# Altium schematic sheet Root.SchDoc
size A4; SheetNumber: 1; SheetTotal: 6
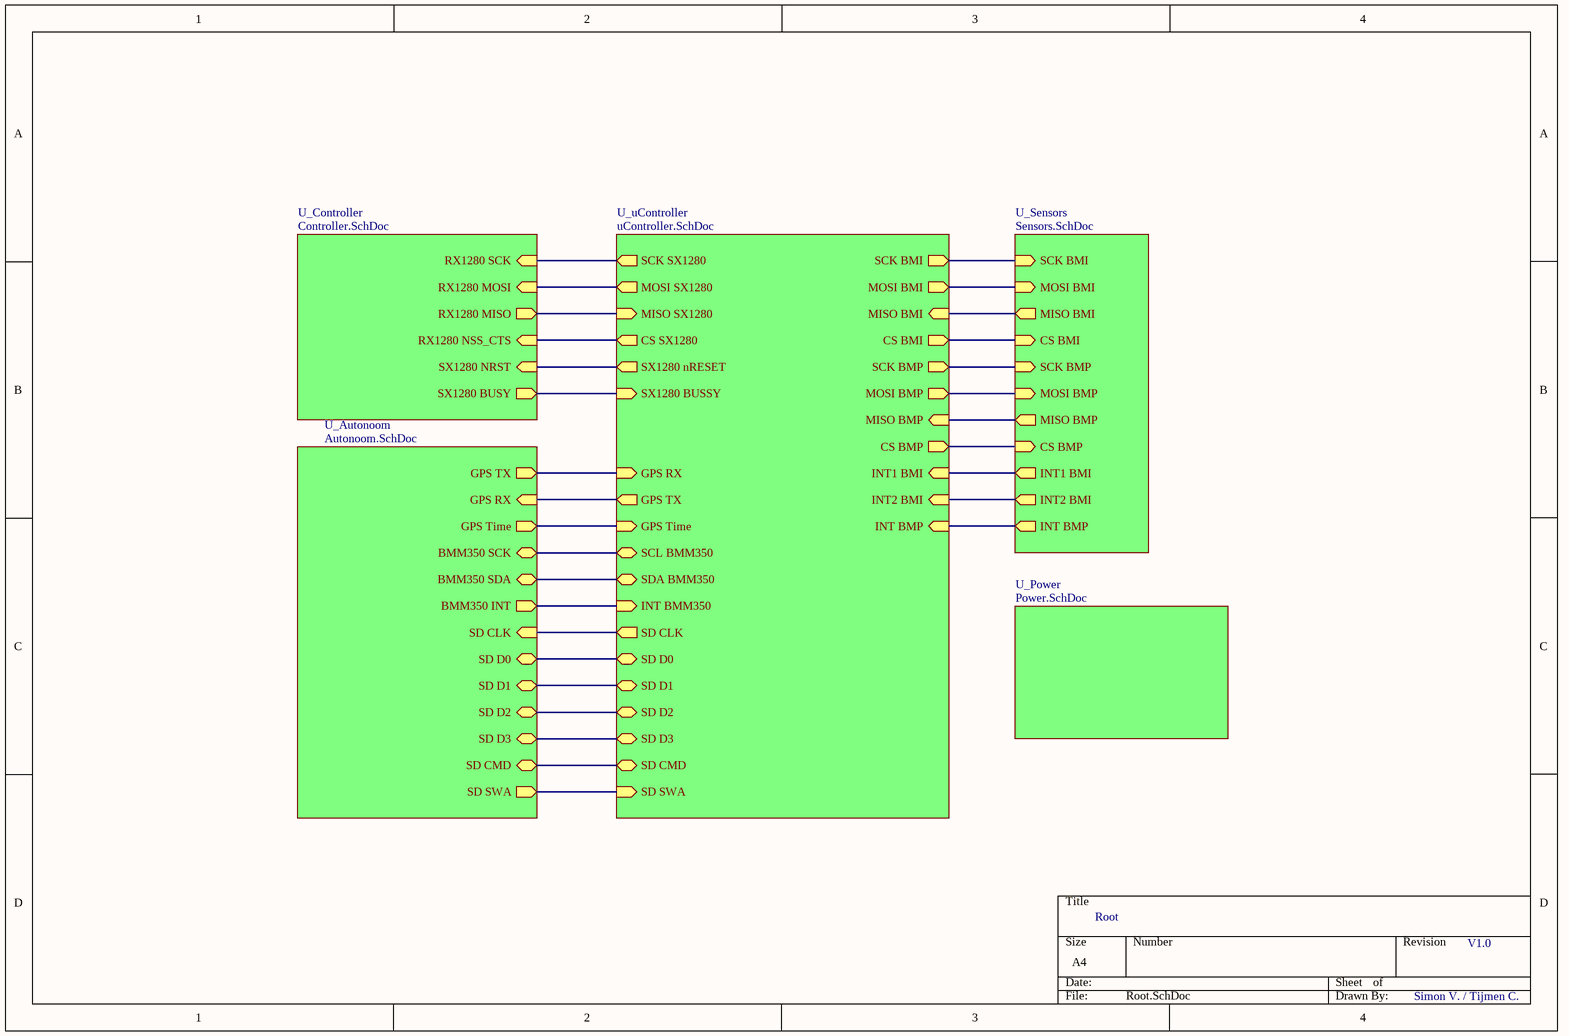
[diagram p0: Root.SchDoc]

## Sub-sheets
U_Autonoom = Autonoom.SchDoc: GPS RX (in), GPS TX (out), GPS Time (out), BMM350 INT (out), BMM350 SDA (bidir), BMM350 SCK (bidir), SD CMD (bidir), SD D3 (bidir), SD D2 (bidir), SD D0 (bidir), SD D1 (bidir), SD SWA (out), SD CLK (in)
U_Controller = Controller.SchDoc: SX1280 BUSY (out), SX1280 NRST (in), RX1280 MISO (out), RX1280 MOSI (in), RX1280 SCK (in), RX1280 NSS_CTS (in)
U_Power = Power.SchDoc: no entries
U_Sensors = Sensors.SchDoc: MOSI BMI (in), SCK BMI (in), CS BMI (in), MISO BMI (out), MOSI BMP (in), SCK BMP (in), CS BMP (in), MISO BMP (out), INT1 BMI (out), INT2 BMI (out), INT BMP (out)
U_uController = uController.SchDoc: CS BMI (out), CS SX1280 (out), MISO BMI (in), MISO SX1280 (in), MOSI BMI (out), MOSI SX1280 (out), SCK BMI (out), SCK SX1280 (out), CS BMP (out), MISO BMP (in), MOSI BMP (out), SCK BMP (out), GPS Time (in), SX1280 nRESET (out), SX1280 BUSSY (in), GPS RX (in), GPS TX (out), INT BMM350 (in), SDA BMM350 (bidir), SCL BMM350 (bidir), SD SWA (in), SD CLK (out), SD D0 (bidir), SD D1 (bidir), SD D2 (bidir), SD D3 (bidir), SD CMD (bidir), INT1 BMI (in), INT2 BMI (in), INT BMP (in)

## Nets
(unnamed): sheet U_uController/CS BMI, sheet U_Sensors/CS BMI
(unnamed): sheet U_uController/CS SX1280, sheet U_Controller/RX1280 NSS_CTS
(unnamed): sheet U_uController/MISO BMI, sheet U_Sensors/MISO BMI
(unnamed): sheet U_uController/MISO SX1280, sheet U_Controller/RX1280 MISO
(unnamed): sheet U_uController/MOSI BMI, sheet U_Sensors/MOSI BMI
(unnamed): sheet U_uController/MOSI SX1280, sheet U_Controller/RX1280 MOSI
(unnamed): sheet U_uController/SCK BMI, sheet U_Sensors/SCK BMI
(unnamed): sheet U_uController/SCK SX1280, sheet U_Controller/RX1280 SCK
(unnamed): sheet U_uController/CS BMP, sheet U_Sensors/CS BMP
(unnamed): sheet U_uController/MISO BMP, sheet U_Sensors/MISO BMP
(unnamed): sheet U_uController/MOSI BMP, sheet U_Sensors/MOSI BMP
(unnamed): sheet U_uController/SCK BMP, sheet U_Sensors/SCK BMP
(unnamed): sheet U_uController/GPS Time, sheet U_Autonoom/GPS Time
(unnamed): sheet U_uController/SX1280 nRESET, sheet U_Controller/SX1280 NRST
(unnamed): sheet U_uController/SX1280 BUSSY, sheet U_Controller/SX1280 BUSY
(unnamed): sheet U_uController/GPS RX, sheet U_Autonoom/GPS TX
(unnamed): sheet U_uController/GPS TX, sheet U_Autonoom/GPS RX
(unnamed): sheet U_uController/INT BMM350, sheet U_Autonoom/BMM350 INT
(unnamed): sheet U_uController/SDA BMM350, sheet U_Autonoom/BMM350 SDA
(unnamed): sheet U_uController/SCL BMM350, sheet U_Autonoom/BMM350 SCK
(unnamed): sheet U_uController/SD SWA, sheet U_Autonoom/SD SWA
(unnamed): sheet U_uController/SD CLK, sheet U_Autonoom/SD CLK
(unnamed): sheet U_uController/SD D0, sheet U_Autonoom/SD D0
(unnamed): sheet U_uController/SD D1, sheet U_Autonoom/SD D1
(unnamed): sheet U_uController/SD D2, sheet U_Autonoom/SD D2
(unnamed): sheet U_uController/SD D3, sheet U_Autonoom/SD D3
(unnamed): sheet U_uController/SD CMD, sheet U_Autonoom/SD CMD
(unnamed): sheet U_uController/INT1 BMI, sheet U_Sensors/INT1 BMI
(unnamed): sheet U_uController/INT2 BMI, sheet U_Sensors/INT2 BMI
(unnamed): sheet U_uController/INT BMP, sheet U_Sensors/INT BMP

## Notes on the sheet
- Root
- V1.0
- Simon V. / Tijmen C.